# EasyEDA schematic SCH_5Vdc_1Adc_power_supply_circuit_2024-01-09.json
TITLE: 5Vdc and 1Adc Power Supply; REV: 1.0; Date: 2024-01-09; Sheet: 1/1; Drawn By: Mortrack8; Company: None
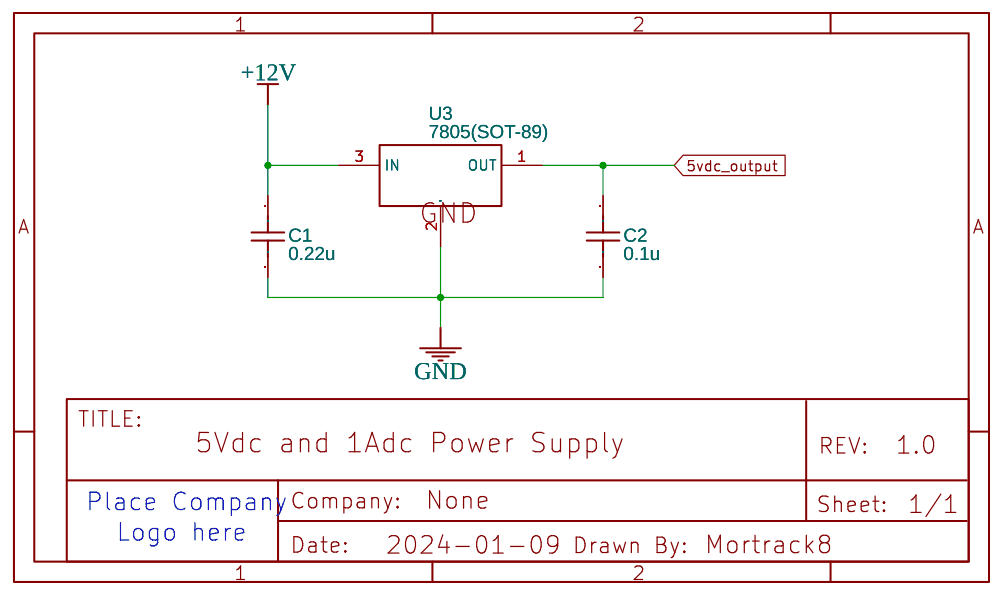
[diagram p0: schematic sheet]

## Parts
C1  0.22u  [RAD-0.3]
C2  0.1u  [RAD-0.3]
U3  7805(SOT-89)  [SOT-89-3_L4.5-W2.5-P1.50-LS4.2-BR]

## Library data of the parts
C1 C2 = C_RAD-0.3_US: Contributor: LCEDA_Lib
U3 = 7805(SOT-89): Supplier: LCSC; Manufacturer: CJ; Manufacturer Part: CJ78L05; image: //image.lceda.cn/szlcsc/C2079.jpg; Supplier Part: C2079; Paste Type: expand; Contributor: LCEDA_Lib

## Nets
5vdc_output: C2.1 U3.1(OUT)
+12V: C1.1 U3.3(IN)
GND: C1.2 C2.2 U3.2(GND)

## Notes on the sheet
- Place Company
- Logo here
